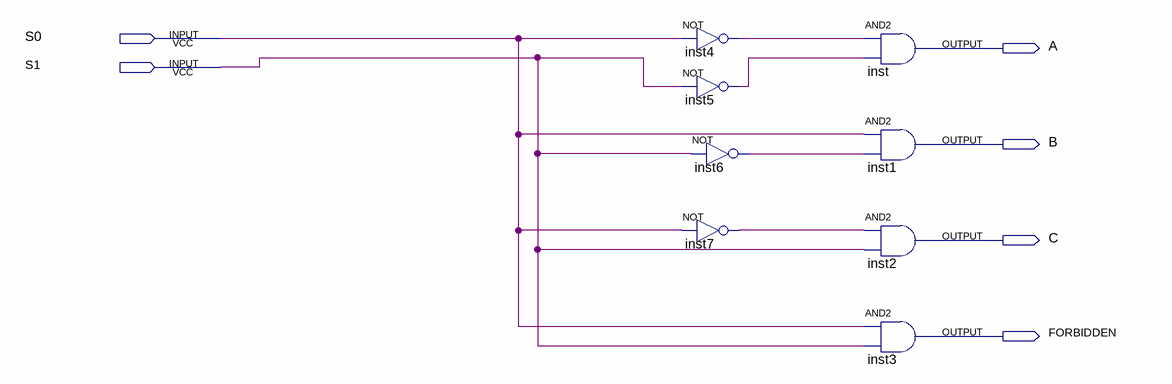
[diagram p0: schematic sheet]
// Quartus schematic SelectREG.bdf as structural Verilog: 8 symbols, 6 pins
module SelectREG (
  input  S0,
  input  S1,
  output A,
  output B,
  output C,
  output FORBIDDEN
);

  wire inst4_out, inst5_out, inst6_out, inst7_out;

  not inst4 (inst4_out, S0);
  not inst5 (inst5_out, S1);
  not inst6 (inst6_out, S1);
  not inst7 (inst7_out, S0);
  and inst (A, inst4_out, inst5_out);
  and inst1 (B, S0, inst6_out);
  and inst2 (C, inst7_out, S1);
  and inst3 (FORBIDDEN, S0, S1);
endmodule
